# Altium schematic sheet debugging_board_3_KEY1.SchDoc
size A4
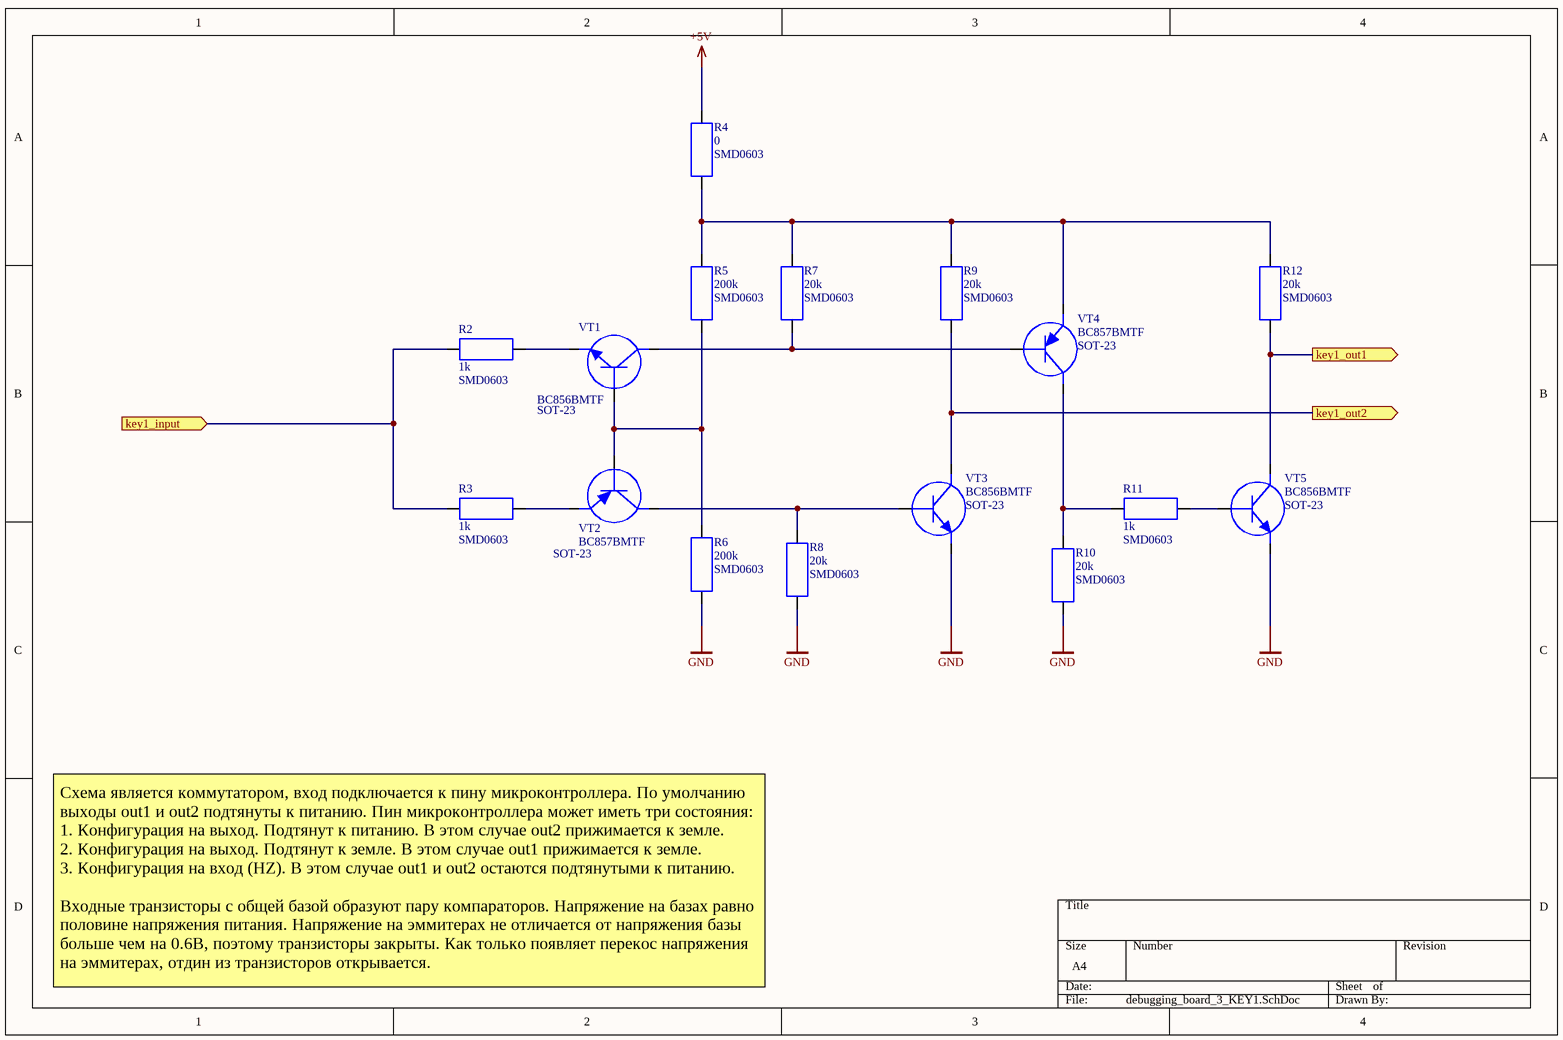
[diagram p0: debugging_board_3_KEY1.SchDoc]

## Parts
R2  1k  Package: SMD0603  [SMD0603(1005)]
R3  1k  Package: SMD0603  [SMD0603(1005)]
R4  0  Package: SMD0603  [SMD0603(1005)]
R5  200k  Package: SMD0603  [SMD0603(1005)]
R6  200k  Package: SMD0603  [SMD0603(1005)]
R7  20k  Package: SMD0603  [SMD0603(1005)]
R8  20k  Package: SMD0603  [SMD0603(1005)]
R9  20k  Package: SMD0603  [SMD0603(1005)]
R10  20k  Package: SMD0603  [SMD0603(1005)]
R11  1k  Package: SMD0603  [SMD0603(1005)]
R12  20k  Package: SMD0603  [SMD0603(1005)]
VT1  BC856BMTF  Package: SOT-23  [SOT23-3]
VT2  BC857BMTF  Package: SOT-23  [SOT23-3]
VT3  BC856BMTF  Package: SOT-23  [SOT23-3]
VT4  BC857BMTF  Package: SOT-23  [SOT23-3]
VT5  BC856BMTF  Package: SOT-23  [SOT23-3]

## Ports
key1_input (in), key1_out1 (out), key1_out2 (out)

## Nets
+5V: R4.1
GND: R6.2 R8.2 R10.2 VT3.2 VT5.2
key1_input: R2.2 R3.2 ; port key1_input
key1_out1: R12.2 VT5.3 ; port key1_out1
key1_out2: R9.2 VT3.3 ; port key1_out2
NetR2_1: R2.1 VT1.2
NetR3_1: R3.1 VT2.2
NetR4_2: R4.2 R5.1 R7.1 R9.1 R12.1 VT4.2
NetR5_2: R5.2 R6.1 VT1.1 VT2.1
NetR7_2: R7.2 VT1.3 VT4.1
NetR8_1: R8.1 VT2.3 VT3.1
NetR10_1: R10.1 R11.2 VT4.3
NetR11_1: R11.1 VT5.1

## Notes on the sheet
- Схема является коммутатором, вход подключается к пину микроконтроллера. По умолчанию выходы out1 и out2 подтянуты к питанию. Пин микроконтроллера может иметь три состояния:
  1. Конфигурация на выход. Подтянут к питанию. В этом случае out2 прижимается к земле.
  2. Конфигурация на выход. Подтянут к земле. В этом случае out1 прижимается к земле.
  3. Конфигурация на вход (HZ). В этом случае out1 и out2 остаются подтянутыми к питанию.
  Входные транзисторы с общей базой образуют пару компараторов. Напряжение на базах равно половине напряжения питания. Напряжение на эммитерах не отличается от напряжения базы больше чем на 0.6В, поэтому транзисторы закрыты. Как только появляет перекос напряжения на эммитерах, отдин из транзисторов открывается.

## Library data of the parts
R2 R3 R11 = R_0603: ValueBOM: Резистор 1кОм SMD 0603 1%; Type: R; Value: 1k
R4 = R_0603: ValueBOM: Резистор 0 Ом SMD 0603 1%; Type: R; Value: 0
R5 R6 = R_0603: ValueBOM: Резистор 200кОм SMD 0603 1%; Type: R; Value: 200k
R7-R10 R12 = R_0603: ValueBOM: Резистор 20кОм SMD 0603 1%; Type: R; Value: 20k
VT1 VT3 VT5 = VT_NPN_SOT23_3: Type: VT; ValueBOM: Транзистор биполярный NPN BC856BMTF SOT23; Value: BC856BMTF
VT2 VT4 = VT_PNP_SOT23_3: Type: VT; ValueBOM: Транзистор биполярный PNP BC857BMTF SOT23; Value: BC857BMTF